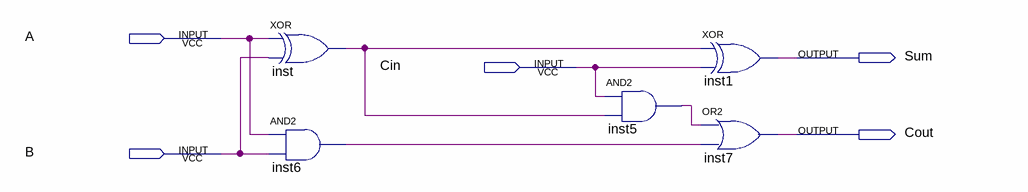
[diagram p0: schematic sheet]
// Quartus schematic bit_a_bit.bdf as structural Verilog: 5 symbols, 5 pins
module bit_a_bit (
  input  A,
  input  Cin,
  input  B,
  output Sum,
  output Cout
);

  wire inst5_out, inst6_out, inst_out;

  xor inst (inst_out, A, B);
  and inst6 (inst6_out, A, B);
  and inst5 (inst5_out, Cin, inst_out);
  xor inst1 (Sum, inst_out, Cin);
  or inst7 (Cout, inst5_out, inst6_out);
endmodule
